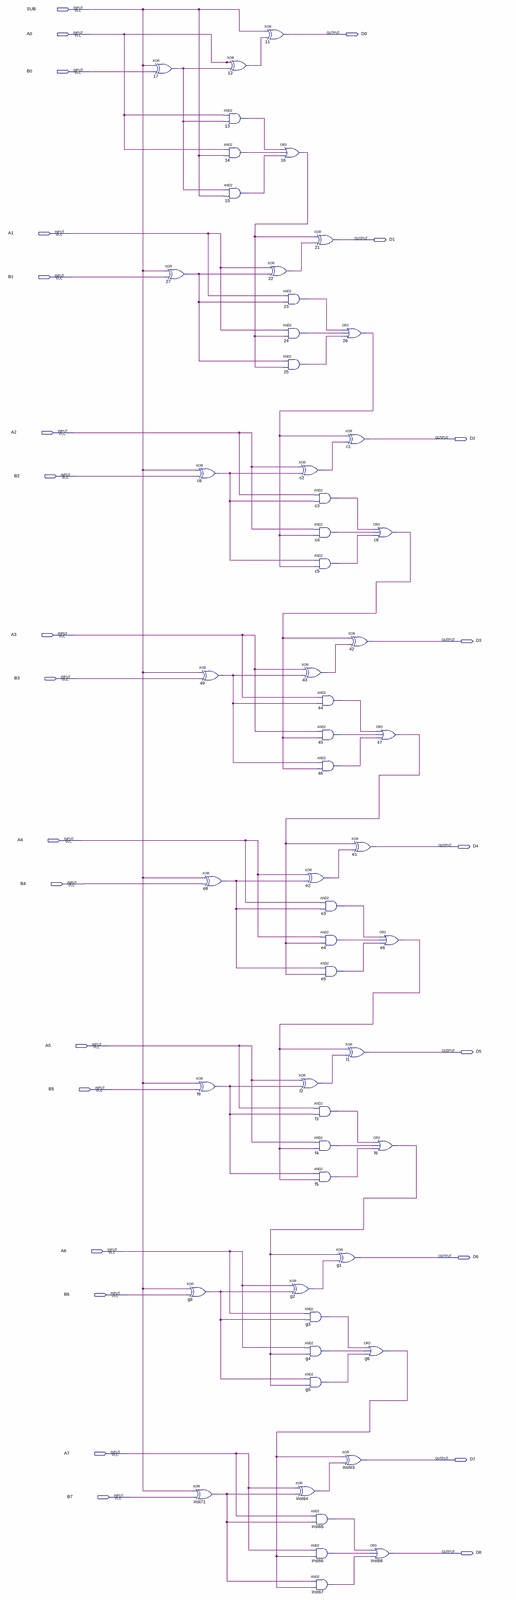
[diagram p0: schematic sheet, whole]
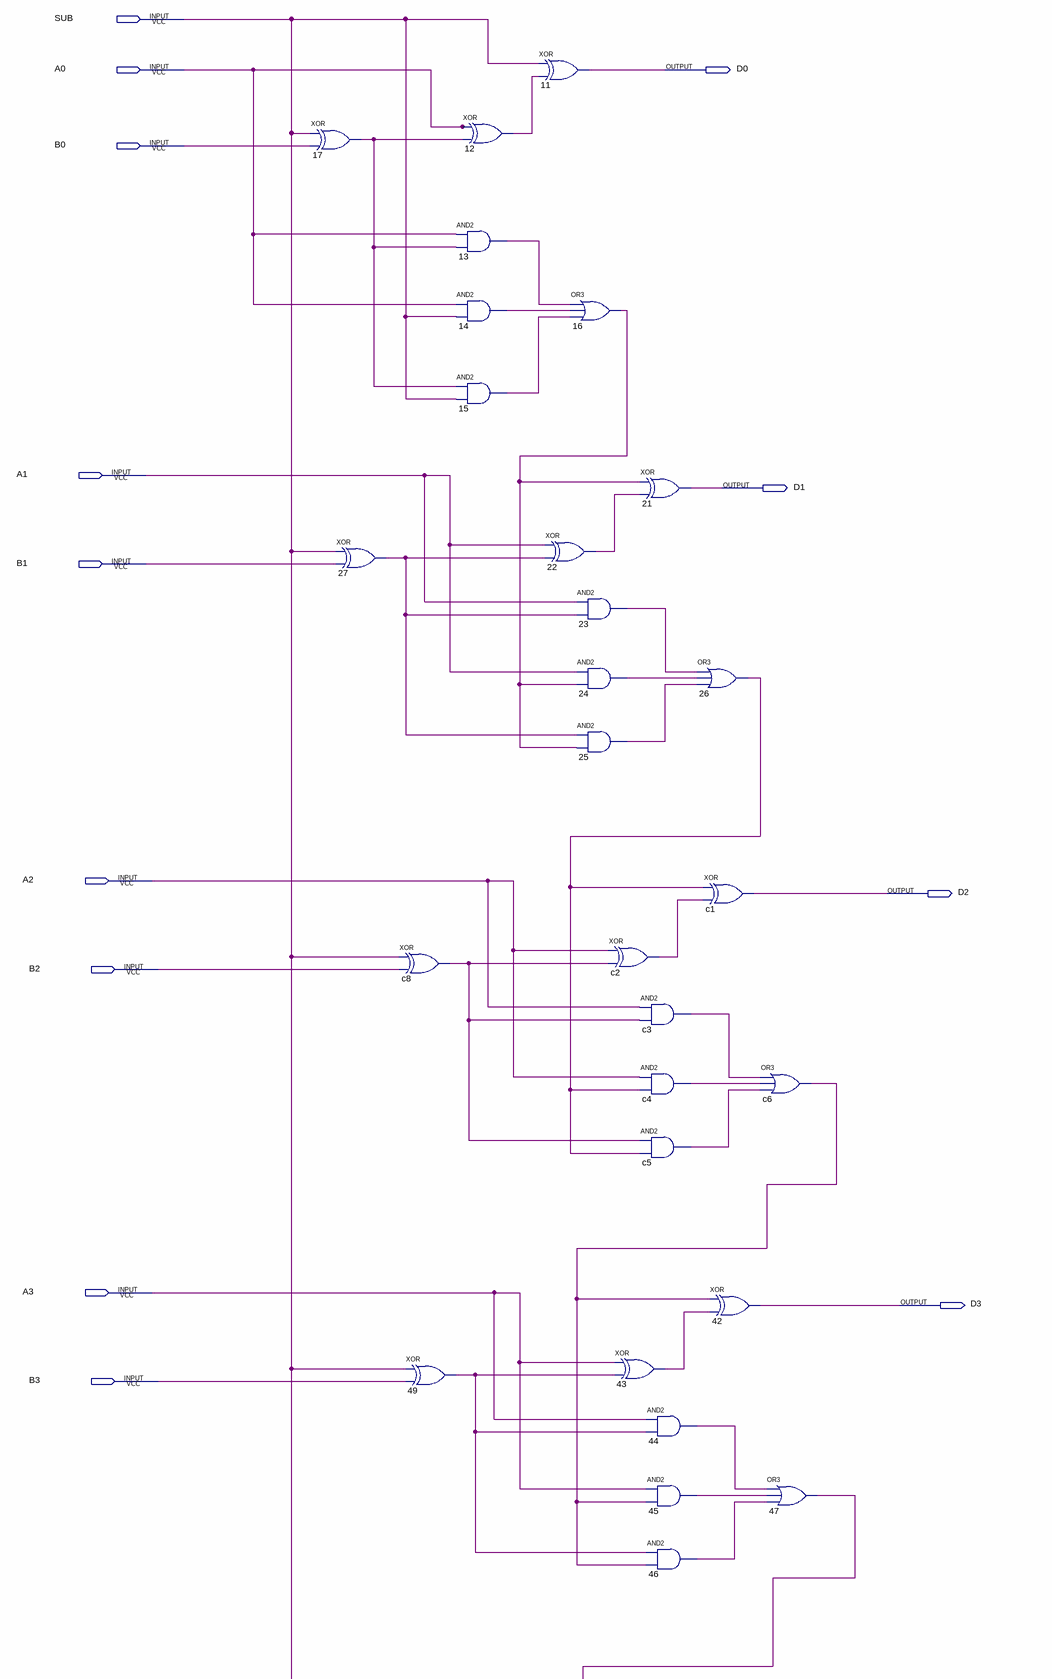
[diagram p1: schematic sheet, upper part]
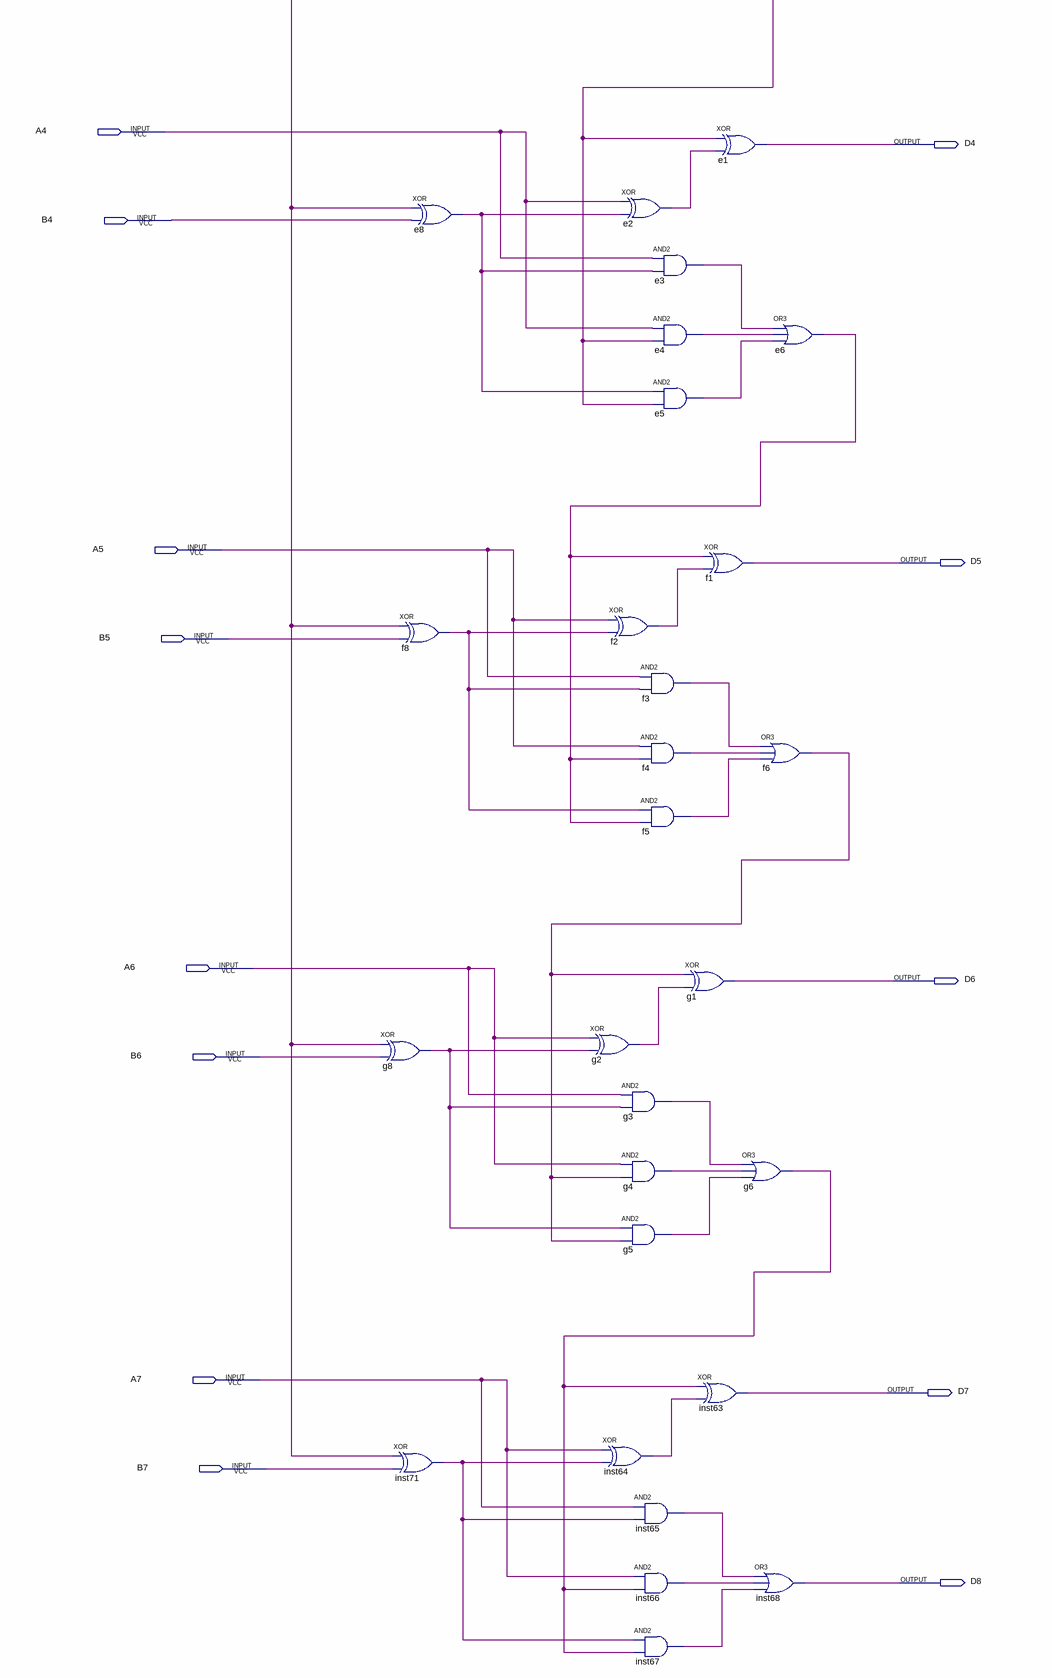
[diagram p2: schematic sheet, lower part]
// Quartus schematic AddSubCircuit.bdf as structural Verilog: 56 symbols, 26 pins
module AddSubCircuit (
  input  SUB,
  input  A0,
  input  B0,
  input  A1,
  input  B1,
  input  A2,
  input  B2,
  input  A3,
  input  B3,
  input  A4,
  input  B4,
  input  A5,
  input  B5,
  input  A6,
  input  B6,
  input  A7,
  input  B7,
  output D0,
  output D1,
  output D2,
  output D3,
  output D4,
  output D5,
  output D6,
  output D7,
  output D8
);

  wire c2_out, c3_out, c4_out, c5_out, c6_out, c8_out, e2_out, e3_out, e4_out, e5_out, e6_out, e8_out,
       f2_out, f3_out, f4_out, f5_out, f6_out, f8_out, g2_out, g3_out, g4_out, g5_out, g6_out, g8_out,
       inst64_out, inst65_out, inst66_out, inst67_out, inst71_out, n12_out, n13_out, n14_out, n15_out,
       n16_out, n17_out, n22_out, n23_out, n24_out, n25_out, n26_out, n27_out, n43_out, n44_out, n45_out,
       n46_out, n47_out, n49_out;

  xor u_17 (n17_out, SUB, B0);
  xor u_27 (n27_out, SUB, B1);
  xor g8 (g8_out, SUB, B6);
  xor inst71 (inst71_out, SUB, B7);
  xor c8 (c8_out, SUB, B2);
  xor u_49 (n49_out, SUB, B3);
  xor e8 (e8_out, SUB, B4);
  xor f8 (f8_out, SUB, B5);
  xor u_12 (n12_out, A0, n17_out);
  and u_13 (n13_out, A0, n17_out);
  and u_14 (n14_out, A0, SUB);
  and u_15 (n15_out, n17_out, SUB);
  xor u_11 (D0, SUB, n12_out);
  xor u_22 (n22_out, A1, n27_out);
  or u_16 (n16_out, n13_out, n14_out, n15_out);
  and u_23 (n23_out, A1, n27_out);
  and u_24 (n24_out, A1, n16_out);
  and u_25 (n25_out, n27_out, n16_out);
  xor g2 (g2_out, A6, g8_out);
  xor u_21 (D1, n16_out, n22_out);
  xor c2 (c2_out, A2, c8_out);
  and c3 (c3_out, A2, c8_out);
  and c4 (c4_out, A2, n26_out);
  and c5 (c5_out, c8_out, n26_out);
  xor u_43 (n43_out, A3, n49_out);
  and u_44 (n44_out, A3, n49_out);
  and u_45 (n45_out, A3, c6_out);
  and u_46 (n46_out, n49_out, c6_out);
  xor e2 (e2_out, A4, e8_out);
  xor f2 (f2_out, A5, f8_out);
  and f3 (f3_out, A5, f8_out);
  and f4 (f4_out, A5, e6_out);
  and f5 (f5_out, f8_out, e6_out);
  and g3 (g3_out, A6, g8_out);
  and g4 (g4_out, A6, f6_out);
  and g5 (g5_out, g8_out, f6_out);
  xor inst64 (inst64_out, A7, inst71_out);
  and inst65 (inst65_out, A7, inst71_out);
  and inst66 (inst66_out, A7, g6_out);
  and inst67 (inst67_out, inst71_out, g6_out);
  or u_26 (n26_out, n23_out, n24_out, n25_out);
  and e3 (e3_out, A4, e8_out);
  and e4 (e4_out, A4, n47_out);
  and e5 (e5_out, e8_out, n47_out);
  xor g1 (D6, f6_out, g2_out);
  xor inst63 (D7, g6_out, inst64_out);
  xor c1 (D2, n26_out, c2_out);
  xor u_42 (D3, c6_out, n43_out);
  xor e1 (D4, n47_out, e2_out);
  xor f1 (D5, e6_out, f2_out);
  or g6 (g6_out, g3_out, g4_out, g5_out);
  or c6 (c6_out, c3_out, c4_out, c5_out);
  or u_47 (n47_out, n44_out, n45_out, n46_out);
  or e6 (e6_out, e3_out, e4_out, e5_out);
  or f6 (f6_out, f3_out, f4_out, f5_out);
  or inst68 (D8, inst65_out, inst66_out, inst67_out);
endmodule
